# Altium schematic sheet Sheet2.SchDoc
size A; SheetNumber: 1; SheetTotal: 1
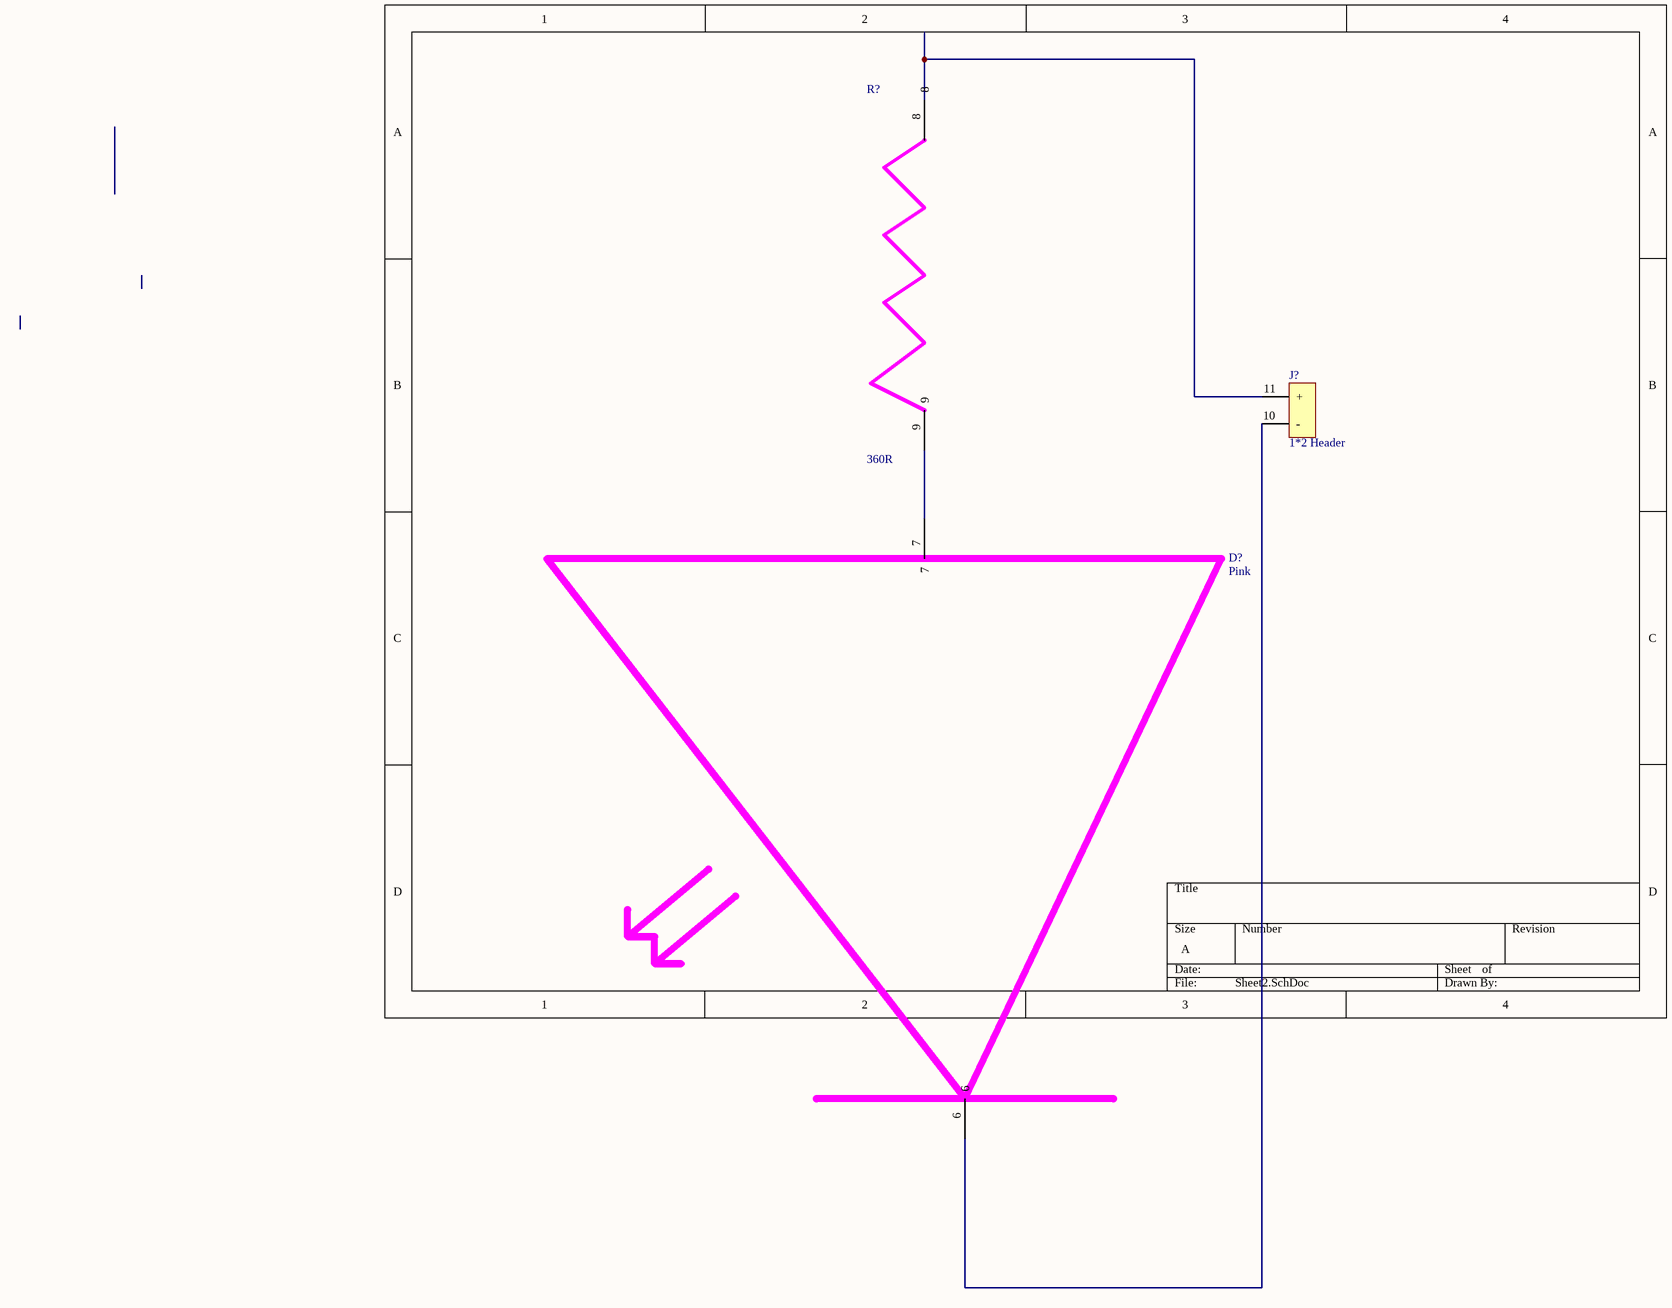
[diagram p0: Sheet2.SchDoc]

## Parts
D?  Pink
J?  1*2 Header
R?  360R

## Nets
NetD?_6: D?.6 J?.10(-)
NetD?_7: D?.7 R?.9

Not connected (* = marked no-connect by the designer): J? 11(+); R? 8

## Library data of the parts
D? = LTST-C230KSKT: Single Color LED, Yellow, Water Clear, 1.6mm; Manufacturer: Vishay Lite-On; Shape: Rectangular; Forward Current: 30mA; Luminous Intensity-Nom: 60mcd; Channels: 1; Viewing Angle: 130°; Overall Height: 1.1mm; Category1: Optoelectronics; Supplier: Rs; Supplier Part Number: 6921102P; Manufacturer Part Number: LTST-C230KSKT; RoHS: Yes; Category: LEDs; Stock: 14600; Pricing: 250=0.072, 500=0.063, 1250=0.05, 2500=0.046 (GBP); Mounting Technology: Surface Mount; Pins: 2; Color: Yellow; Terminal Finish: Tin; Min Operating Temperature: -55°C; Max Operating Temperature: 85°C; Optoelectronic Device Type: SINGLE COLOR LED; Packaging: Tape and Reel; JESD-609 Code: e3; Lens Style: WATER CLEAR; Size: 1.6mm; Terminal Pitch: 3.6mm; RoHS Compliant: Yes; Reach SVHC Compliant: Yes; ComponentLink1URL: https://datasheet.ciiva.com:443/pdfs/VipMasterIC/IC/LITE/LITE-S-A0000737481/LITE-S-A0000737481-1.pdf?src-supplier=IHS+Markit; ComponentLink1Description: https://datasheet.ciiva.com:443/pdfs/VipMasterIC/IC/LITE/LITE-S-A0000737481/LITE-S-A0000737481-1.pdf?src-supplier=IHS+Markit; ComponentLink2URL: https://datasheet.ciiva.com/12400/lite-on-ltst-c230kskt-190176-12400822.pdf?src-supplier=Mouser; ComponentLink2Description: https://datasheet.ciiva.com/12400/lite-on-ltst-c230kskt-190176-12400822.pdf?src-supplier=Mouser; ComponentLink3URL: https://datasheet.ciiva.com/15117/getdatasheetpartid-102787-15117430.pdf?src-supplier=Verical; ComponentLink3Description: https://datasheet.ciiva.com/15117/getdatasheetpartid-102787-15117430.pdf?src-supplier=Verical; ComponentLink4URL: https://datasheet.ciiva.com/11775/0900766b80dc057c-11775435.pdf?src-supplier=Rs; ComponentLink4Description: https://datasheet.ciiva.com/11775/0900766b80dc057c-11775435.pdf?src-supplier=Rs; ComponentLink5URL: https://datasheet.ciiva.com/2110/s-110-ltst-c230kskt-2110187.pdf?src-supplier=Digikey; ComponentLink5Description: https://datasheet.ciiva.com/2110/s-110-ltst-c230kskt-2110187.pdf?src-supplier=Digikey; ComponentLink6URL: https://datasheet.ciiva.com/2110/s-110-ltst-c230kskt-2110188.pdf?src-supplier=Digikey; ComponentLink6Description: https://datasheet.ciiva.com/2110/s-110-ltst-c230kskt-2110188.pdf?src-supplier=Digikey; ComponentLink7URL: https://datasheet.ciiva.com/16394/ltst-c230kskt-16394349.pdf?src-supplier=Future+Electronics; ComponentLink7Description: https://datasheet.ciiva.com/16394/ltst-c230kskt-16394349.pdf?src-supplier=Future+Electronics
J? = 0022292021: Board Connector, 2 Contact(s), 1 Row(s), Male, Straight, Solder Terminal; Manufacturer: Molex; Supplier: Mouser; Supplier Part Number: 538-22-29-2021; Manufacturer Part Number: 0022292021; RoHS: No; Stock: 10573; Pricing: 1=0.46, 10=0.314, 50=0.314, 100=0.264, 1000=0.252, 10000=0.201 (USD); Category: Connectors
R? = RC0805FR-07360RL: Fixed Resistor, Metal Glaze/thick Film, 0.125W, 360ohm, 150V, 1% +/-Tol, 100ppm/Cel, Surface Mount, 0805; Manufacturer: Yageo; Additional Feature: LASER TRIMMABLE; Power: 125mW; Rated Temperature: 70°C; Temperature Coefficient: 100ppm/°C; Package Height: 0.5mm; Package Length: 2mm; Package Width: 1.25mm; Category2: Resistors; Supplier: Future Electronics; Supplier Part Number: 1029238; Manufacturer Part Number: RC0805FR-07360RL; RoHS: Yes; Category: Chip SMD Resistors; Stock: 75000; Pricing: 5000=0.0025, 25000=0.0024, 100000=0.0023, 250000=0.0022, 625000=0.0021 (USD); Mounting Technology: Surface Mount; Pins: 2; Package Shape: Rectangular; Case/Package: 0805; Terminal Finish: Nickel; Min Operating Temperature: -55°C; Max Operating Temperature: 155°C; Tolerance: 1%; JESD-609 Code: e3; Resistor Type: FIXED RESISTOR; Construction: Chip; Package Style: SMTMeter; Packaging: Tape and Reel; Value: 360R; Technology: METAL GLAZE/THICK FILM; Termination: Wraparound; Working Voltage: 150V; Reach SVHC Compliant: Yes; RoHS Compliant: Yes; ComponentLink1URL: https://datasheet.ciiva.com:443/pdfs/VipMasterIC/IC/YAGO/YAGO-S-A0008145938/YAGO-S-A0008145938-1.pdf?src-supplier=IHS+Markit; ComponentLink1Description: https://datasheet.ciiva.com:443/pdfs/VipMasterIC/IC/YAGO/YAGO-S-A0008145938/YAGO-S-A0008145938-1.pdf?src-supplier=IHS+Markit; ComponentLink2URL: https://datasheet.ciiva.com/11808/0900766b8106beab-11808261.pdf?src-supplier=Rs; ComponentLink2Description: https://datasheet.ciiva.com/11808/0900766b8106beab-11808261.pdf?src-supplier=Rs; ComponentLink3URL: https://datasheet.ciiva.com/12667/rc0805-12667401.pdf?src-supplier=Mouser; ComponentLink3Description: https://datasheet.ciiva.com/12667/rc0805-12667401.pdf?src-supplier=Mouser; ComponentLink4URL: https://datasheet.ciiva.com/17423/rc0805-17423149.pdf?src-supplier=Future+Electronics; ComponentLink4Description: https://datasheet.ciiva.com/17423/rc0805-17423149.pdf?src-supplier=Future+Electronics